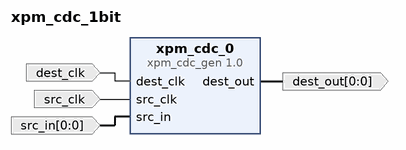
[diagram p0: block diagram of the top level]
# Vivado block design xpm_cdc_1bit, xck26-sfvc784-2LVI-i, Vivado 2023.1
create_bd_design xpm_cdc_1bit

create_bd_port -dir I -type clk dest_clk
set_property -dict {CONFIG.FREQ_HZ 400000000} [get_bd_ports dest_clk]
create_bd_port -dir O -from 0 -to 0 dest_out
create_bd_port -dir I -type clk src_clk
set_property -dict {CONFIG.FREQ_HZ 200000000} [get_bd_ports src_clk]
create_bd_port -dir I -from 0 -to 0 src_in

create_bd_cell -type ip -vlnv xilinx.com:ip:xpm_cdc_gen:1.0 xpm_cdc_0
set_property -dict {CONFIG.CDC_TYPE xpm_cdc_single} [get_bd_cells xpm_cdc_0]

# ---- connections ----

connect_bd_net -net dest_clk_0_1 [get_bd_ports dest_clk] [get_bd_pins xpm_cdc_0/dest_clk]
connect_bd_net -net src_clk_0_1 [get_bd_ports src_clk] [get_bd_pins xpm_cdc_0/src_clk]
connect_bd_net -net src_in_0_1 [get_bd_ports src_in] [get_bd_pins xpm_cdc_0/src_in]
connect_bd_net [get_bd_pins xpm_cdc_0/dest_out] [get_bd_ports dest_out]

validate_bd_design
save_bd_design
